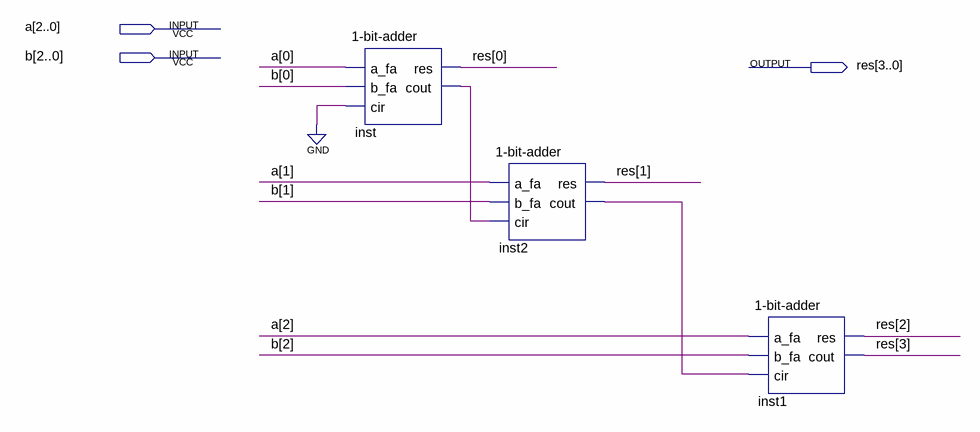
[diagram p0: schematic sheet]
// Quartus schematic full-adder-3bit.bdf as structural Verilog: 3 symbols, 3 pins
module \full-adder-3bit  (
  input  [2:0] a,
  input  [2:0] b,
  output [3:0] res
);

  wire inst2_cout, inst_cout;

  \1-bit-adder  inst (.a_fa(a[0]), .b_fa(b[0]), .cir(1'b0), .res(res[0]), .cout(inst_cout));
  \1-bit-adder  inst2 (.a_fa(a[1]), .b_fa(b[1]), .cir(inst_cout), .res(res[1]), .cout(inst2_cout));
  \1-bit-adder  inst1 (.a_fa(a[2]), .b_fa(b[2]), .cir(inst2_cout), .res(res[2]), .cout(res[3]));
endmodule
